# EAGLE design mother_board (EAGLE 8.3.2)
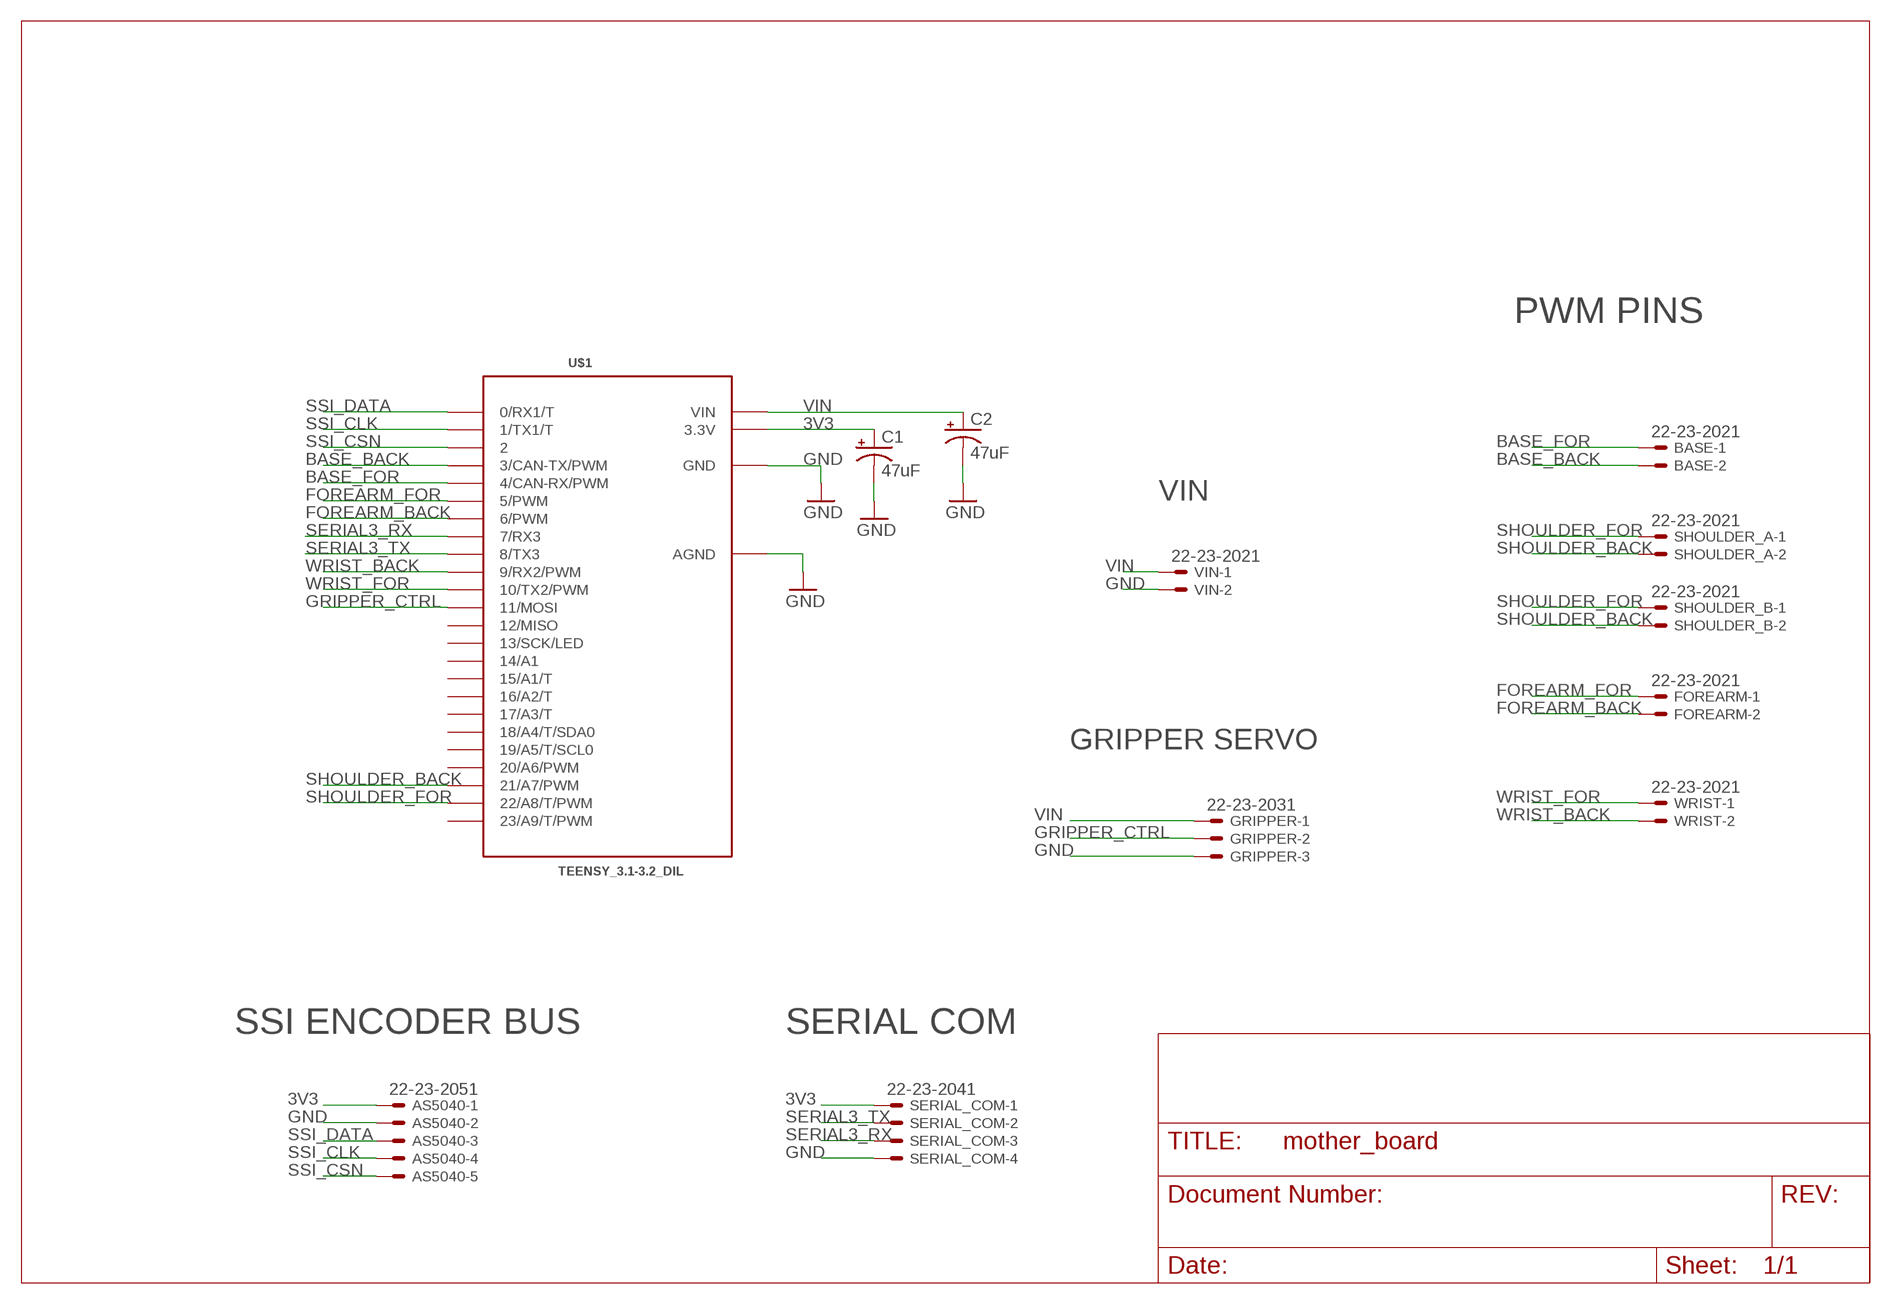
[diagram p0: schematic, sheet 1]

## Parts
AS5040  22-23-2051  [22-23-2051]
BASE  22-23-2021  [22-23-2021]
C1  47uF  CPOL-USE2.5-7  [E2,5-7]
C2  47uF  CPOL-USE2.5-7  [E2,5-7]
FOREARM  22-23-2021  [22-23-2021]
GRIPPER  22-23-2031  [22-23-2031]
SERIAL_COM  22-23-2041  [22-23-2041]
SHOULDER_A  22-23-2021  [22-23-2021]
SHOULDER_B  22-23-2021  [22-23-2021]
U$1  TEENSY_3.1-3.2_DIL  [TEENSY_3.0-3.2&LC_DIL]
VIN  22-23-2021  [22-23-2021]
WRIST  22-23-2021  [22-23-2021]

## Nets
3V3: AS5040.1 C1.+ SERIAL_COM.1 U$1.3.3V
BASE_BACK: BASE.2 U$1.3(3/CAN-TX/PWM)
BASE_FOR: BASE.1 U$1.4(4/CAN-RX/PWM)
FOREARM_BACK: FOREARM.2 U$1.6(6/PWM)
FOREARM_FOR: FOREARM.1 U$1.5(5/PWM)
GND: AS5040.2 C1.- C2.- GRIPPER.3 SERIAL_COM.4 U$1.AGND U$1.GND VIN.2
GRIPPER_CTRL: GRIPPER.2 U$1.11(11/MOSI)
SERIAL3_RX: SERIAL_COM.3 U$1.7(7/RX3)
SERIAL3_TX: SERIAL_COM.2 U$1.8(8/TX3)
SHOULDER_BACK: SHOULDER_A.2 SHOULDER_B.2 U$1.21/A7(21/A7/PWM)
SHOULDER_FOR: SHOULDER_A.1 SHOULDER_B.1 U$1.22/A8(22/A8/T/PWM)
SSI_CLK: AS5040.4 U$1.1(1/TX1/T)
SSI_CSN: AS5040.5 U$1.2
SSI_DATA: AS5040.3 U$1.0(0/RX1/T)
VIN: C2.+ GRIPPER.1 U$1.VIN VIN.1
WRIST_BACK: U$1.9(9/RX2/PWM) WRIST.2
WRIST_FOR: U$1.10(10/TX2/PWM) WRIST.1
Unconnected: U$1.12(12/MISO) U$1.13(13/SCK/LED) U$1.14/A0(14/A1) U$1.15/A1(15/A1/T) U$1.16/A2(16/A2/T) U$1.17/A3(17/A3/T) U$1.18/A4(18/A4/T/SDA0) U$1.19/A5(19/A5/T/SCL0) U$1.20/A6(20/A6/PWM) U$1.23/A9(23/A9/T/PWM)

## Notes on the sheet
- PWM PINS
- VIN
- GRIPPER SERVO
- SSI ENCODER BUS | SERIAL COM

## Library data of the parts
AS5040 = con-molex:22-23-2051: .100" (2.54mm) Center Header - 5 Pin; MF: MOLEX; MPN: 22-23-2051; OC_FARNELL: 1462952; OC_NEWARK: 38C9178
BASE FOREARM SHOULDER_A SHOULDER_B VIN WRIST = con-molex:22-23-2021: .100" (2.54mm) Center Header - 2 Pin; MF: MOLEX; MPN: 22-23-2021; OC_FARNELL: 1462926; OC_NEWARK: 25C3832
C1 C2 = rcl:CPOL-US: POLARIZED CAPACITOR, American symbol
GRIPPER = con-molex:22-23-2031: .100" (2.54mm) Center Header - 3 Pin; MF: MOLEX; MPN: 22-23-2031; OC_FARNELL: 1462950; OC_NEWARK: 30C0862
SERIAL_COM = con-molex:22-23-2041: .100" (2.54mm) Center Header - 4 Pin; MF: MOLEX; MPN: 22-23-2041; OC_FARNELL: 1462920; OC_NEWARK: 38C0355
U$1 = Teensy_3_and_LC_Series_Boards_v1.4:TEENSY_3.1-3.2_DIL: Teensy 3.1 or 3.2 in a DIL Layout.

## Board
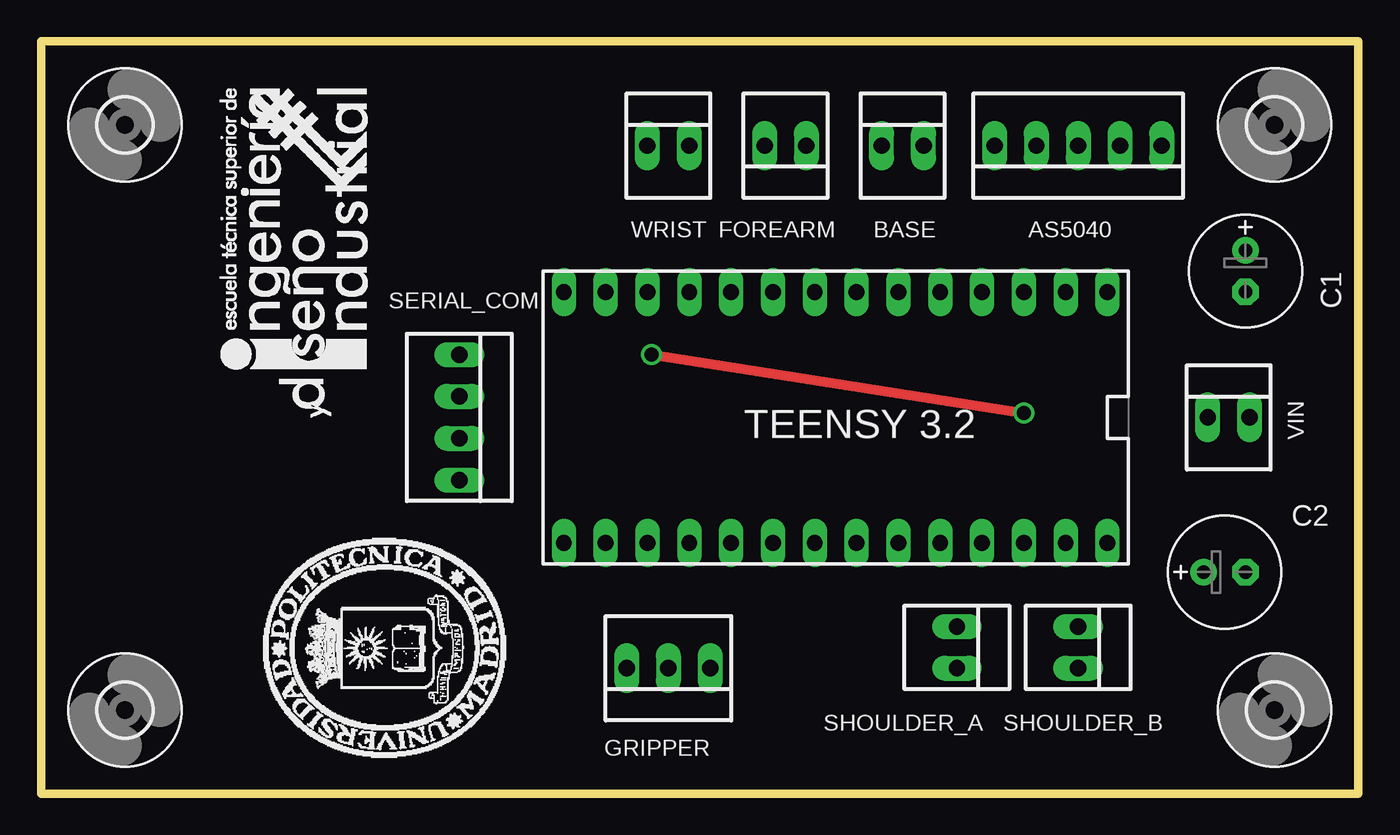
[diagram p1: board, top side]
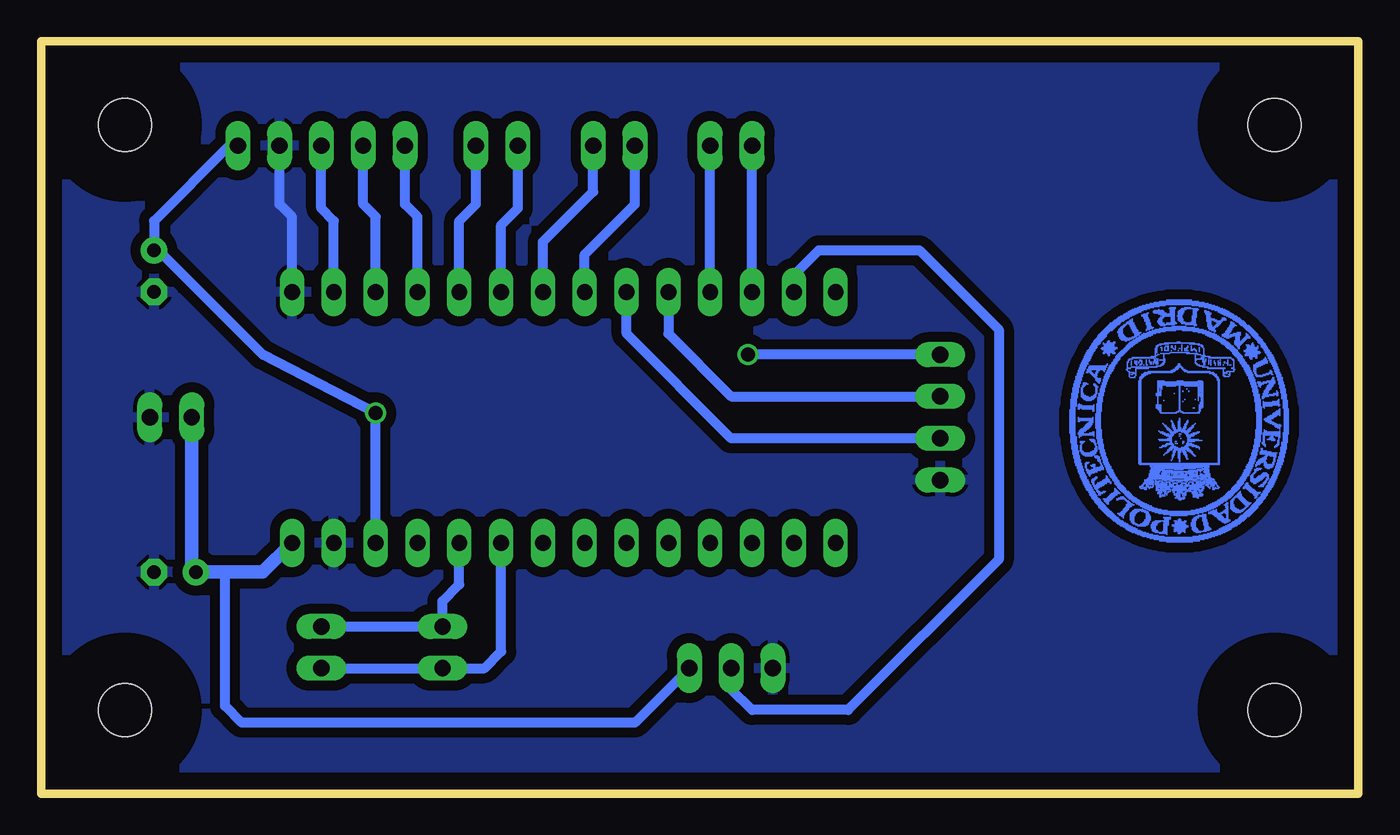
[diagram p2: board, bottom side, seen from below]

Size 80.01 x 45.72 mm. Coordinates in mm from the lower left corner, seen from the top.
Outline: 0,45.72 0,0 80.01,0 80.01,45.72 0,45.72
Copper layers (1*16): Top 0.035mm / dielectric 1.5mm / Bottom 0.035mm
Design rules "default": minimum track width 6mil, minimum drill 0.35mm, track to track 6mil, track to pad 6mil, pad to pad 6mil, via to via 6mil, smd to smd 6mil, copper to edge 40mil, drill to drill 6mil, minimum pad ring 10mil, minimum via ring 8mil, stop-mask expansion 4mil, vias tented up to drill 0mil, thermal gap 10mil

### Footprints (pad centres in the part's own frame; a part is rotated, then mirrored left to right if it is on the bottom)
22-23-2051 = drill 1 long: 1 -5.08,0; 2 -2.54,0; 3 0,0; 4 2.54,0; 5 5.08,0
22-23-2021 = drill 1 long: 1 -1.27,0; 2 1.27,0
E2,5-7 = drill 0.813 pad 1.6: + -1.27,0 | drill 0.813 pad 1.6 octagon: - 1.27,0
22-23-2031 = drill 1 long: 1 -2.54,0; 2 0,0; 3 2.54,0
22-23-2041 = drill 1 long: 1 -3.81,0; 2 -1.27,0; 3 1.27,0; 4 3.81,0
TEENSY_3.0-3.2&LC_DIL = drill 0.965 long: 0 -7.62,13.97; 1 -7.62,11.43; 2 -7.62,8.89; 3 -7.62,6.35; 3.3V 7.62,11.43; 4 -7.62,3.81; 5 -7.62,1.27; 6 -7.62,-1.27; 7 -7.62,-3.81; 8 -7.62,-6.35; 9 -7.62,-8.89; 10 -7.62,-11.43; 11 -7.62,-13.97; 12 -7.62,-16.51; 13 7.62,-16.51; 14/A0 7.62,-13.97; 15/A1 7.62,-11.43; 16/A2 7.62,-8.89; 17/A3 7.62,-6.35; 18/A4 7.62,-3.81; 19/A5 7.62,-1.27; 20/A6 7.62,1.27; 21/A7 7.62,3.81; 22/A8 7.62,6.35; 23/A9 7.62,8.89; AGND 7.62,13.97; GND -7.62,16.51; VIN 7.62,16.51
3,2 = hole 3.2: 0,0

### Placement (x,y rotation side)
AS5040  62.99,39.37 180 top
BASE  52.32,39.37 0 top
C1  73.15,31.75 270 top
C2  71.88,13.46 0 top
FOREARM  45.21,39.37 180 top
GRIPPER  38.1,7.62 180 top
SERIAL_COM  25.4,22.86 270 top
SHOULDER_A  55.63,8.89 270 top
SHOULDER_B  62.99,8.89 270 top
U$1  48.26,22.86 270 top
U$2  [3,2]  5.08,40.64 0 top
U$3  [3,2]  5.08,5.08 0 top
U$4  [3,2]  74.93,5.08 0 top
U$5  [3,2]  74.93,40.64 0 top
U$6  [LOGO_UPM_NAMES]  32,-0.25 90 top
U$7  [LOGO_ETSIDI_NAMES]  19.81,22.86 90 top
U$8  [LOGO_UPM_TOP1]  1.78,33.78 180 bottom
VIN  72.14,22.86 0 top
WRIST  38.1,39.37 0 top

### Tracks (layer width: path | path; a pad name or v marks a point on that pad's centre or on a via)
3V3  (via drill 0.85, 0.85 pad 1.15)
  Top 0.61: v37.08,26.67 v59.69,23.11
  Bottom 0.61: SERIAL_COM.1 v37.08,26.67 | U$1.3.3V v59.69,23.11 66.55,26.67 72.9,33.02 C1.+ 73.15,34.8 68.58,39.37 AS5040.1
BASE_BACK
  Bottom 0.61: U$1.3 54.61,34.8 53.59,35.81 BASE.2
BASE_FOR
  Bottom 0.61: U$1.4 52.07,34.54 51.05,35.56 BASE.1
FOREARM_BACK
  Bottom 0.61: U$1.6 46.99,32.77 43.94,35.81 FOREARM.2
FOREARM_FOR
  Bottom 0.61: U$1.5 49.53,33.53 46.48,36.58 46.48,38.61 46.23,38.86 46.23,39.12 FOREARM.1
GND
  Bottom 0.61: U$1.GND 64.77,35.05 65.53,35.81 AS5040.2
  pour Bottom (isolate 0.61): 0,45.72 0,0 80.01,0 80.01,45.72
GRIPPER_CTRL
  Bottom 0.61: U$1.11 34.29,31.5 32.77,33.02 26.67,33.02 21.84,28.19 21.84,14.22 30.99,5.08 36.83,5.08 38.1,6.35 GRIPPER.2
SERIAL3_RX
  Bottom 0.61: SERIAL_COM.3 38.1,21.59 44.45,27.94 U$1.7
SERIAL3_TX
  Bottom 0.61: U$1.8 41.91,27.94 38.1,24.13 SERIAL_COM.2
SHOULDER_BACK
  Bottom 0.61: SHOULDER_B.2 SHOULDER_A.2 53.09,7.62 52.07,8.64 U$1.21/A7
SHOULDER_FOR
  Bottom 0.61: SHOULDER_B.1 SHOULDER_A.1 55.63,11.68 54.61,12.7 U$1.22/A8
SSI_CLK
  Bottom 0.61: U$1.1 59.69,35.05 60.45,35.81 AS5040.4
SSI_CSN
  Bottom 0.61: U$1.2 57.15,35.05 57.91,35.81 AS5040.5
SSI_DATA
  Bottom 0.61: U$1.0 62.23,34.8 62.99,35.56 AS5040.3
VIN
  Bottom 0.61: GRIPPER.1 43.94,4.32 67.82,4.32 68.83,5.33 68.83,13.46
  Bottom 0.813: VIN.1 70.87,13.72 C2.+ 68.83,13.46 66.55,13.46 U$1.VIN
WRIST_BACK
  Bottom 0.61: U$1.9 WRIST.2
WRIST_FOR
  Bottom 0.61: U$1.10 WRIST.1

### Text on the board
tNames: TEENSY 3.2